# EAGLE schematic PH_EC_Module (EAGLE 9.1.2)

## Sheet 1 of 2
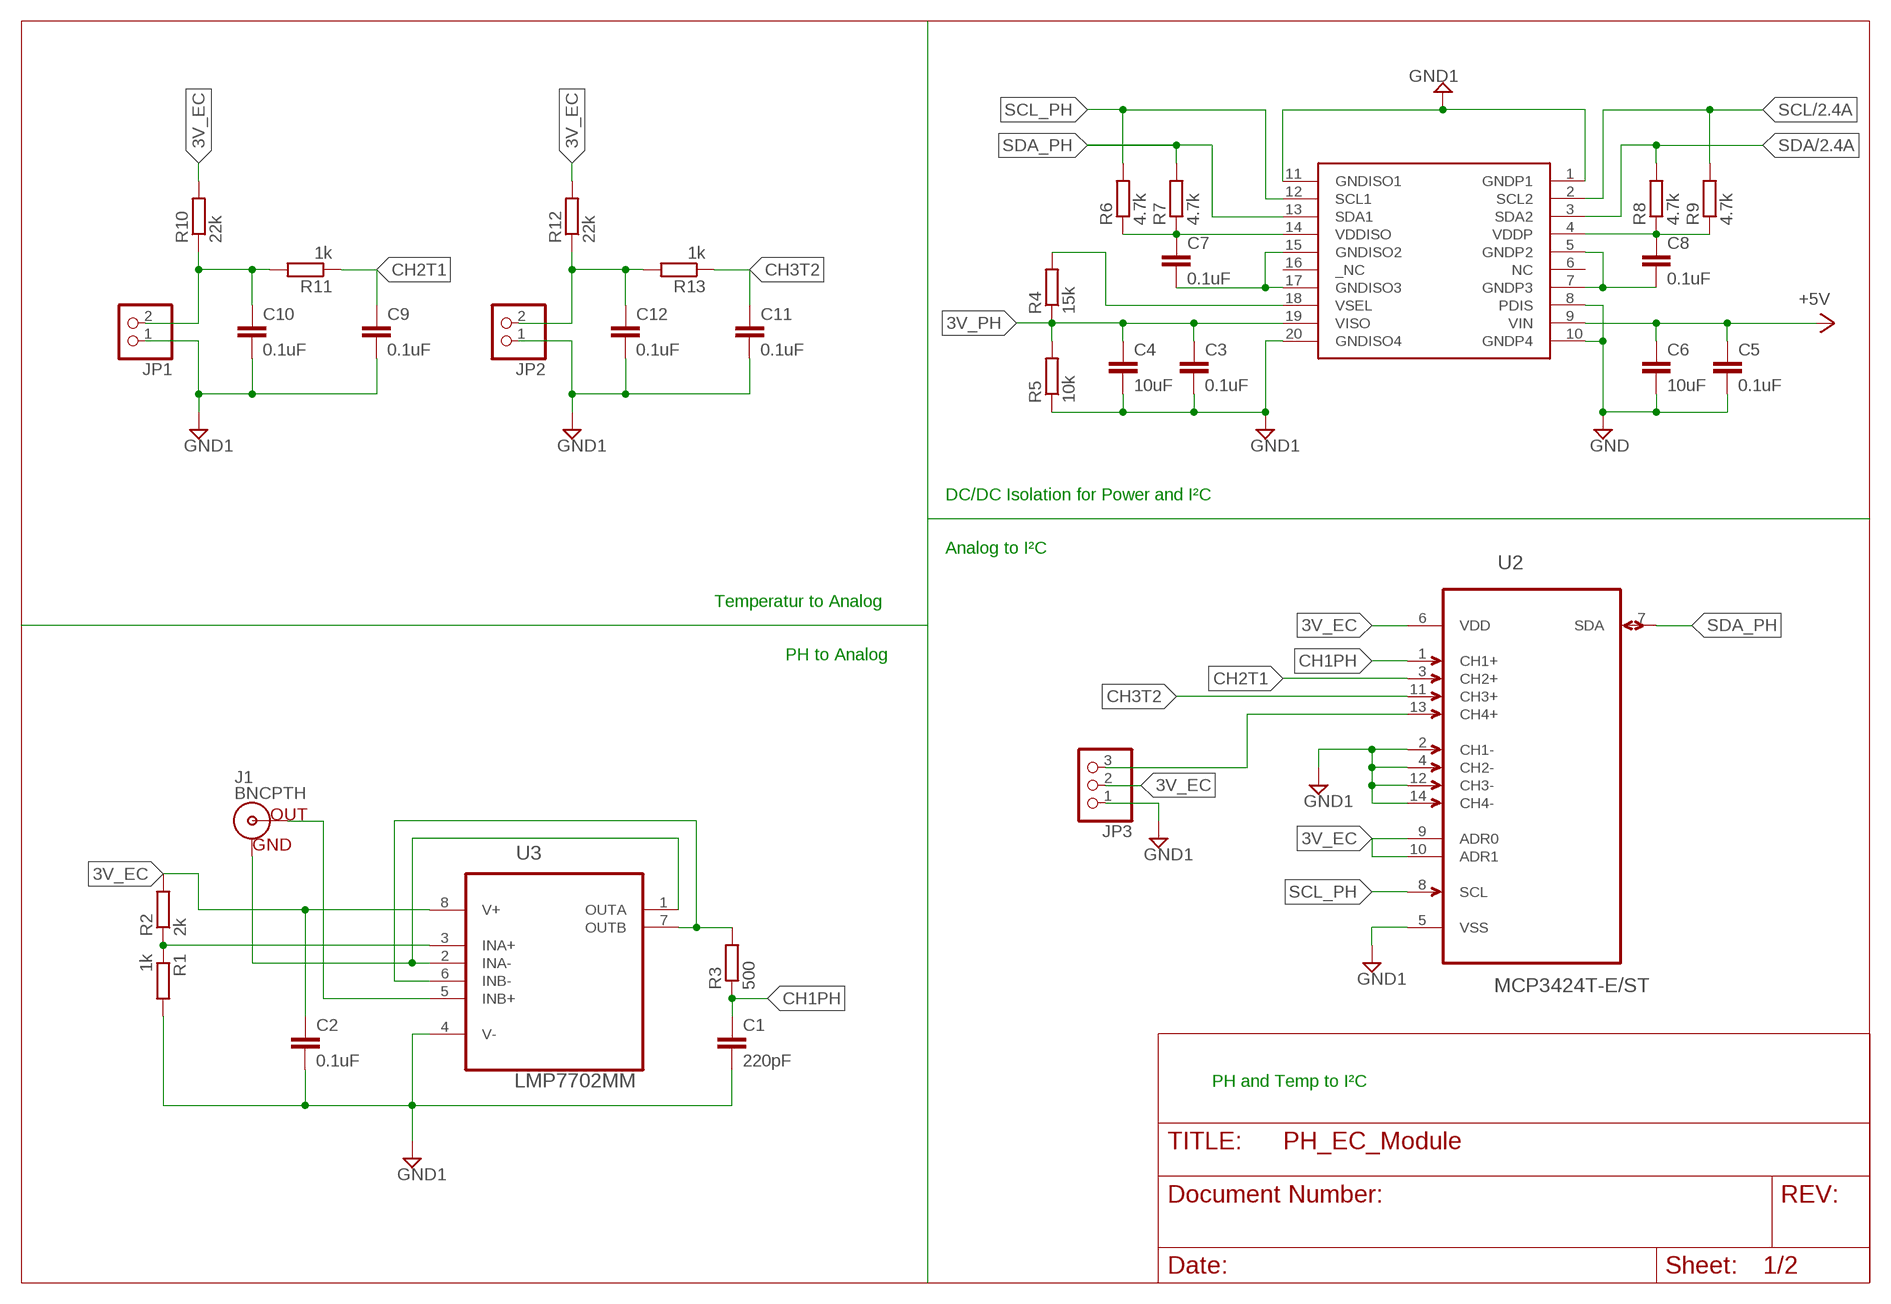
[diagram p0: schematic, sheet 1]

### Parts
C1  220pF  C-EUC1210  [C1210]
C2  0.1uF  C-EUC1210  [C1210]
C3  0.1uF  C-EUC1210  [C1210]
C4  10uF  C-EUC1210  [C1210]
C5  0.1uF  C-EUC1210  [C1210]
C6  10uF  C-EUC1210  [C1210]
C7  0.1uF  C-EUC1210  [C1210]
C8  0.1uF  C-EUC1210  [C1210]
C9  0.1uF  C-EUC1210  [C1210]
C10  0.1uF  C-EUC1210  [C1210]
C11  0.1uF  C-EUC1210  [C1210]
C12  0.1uF  C-EUC1210  [C1210]
J1  BNCPTH  [BNC]
JP1  PINHD-1X2  [1X02]
JP2  PINHD-1X2  [1X02]
JP3  PINHD-1X3  [1X03]
R1  1k  R-EU_M1206  [M1206]
R2  2k  R-EU_M1206  [M1206]
R3  500  R-EU_M1206  [M1206]
R4  15k  R-EU_M1206  [M1206]
R5  10k  R-EU_M1206  [M1206]
R6  4.7k  R-EU_M1206  [M1206]
R7  4.7k  R-EU_M1206  [M1206]
R8  4.7k  R-EU_M1206  [M1206]
R9  4.7k  R-EU_M1206  [M1206]
R10  22k  R-EU_M1206  [M1206]
R11  1k  R-EU_M1206  [M1206]
R12  22k  R-EU_M1206  [M1206]
R13  1k  R-EU_M1206  [M1206]
U1  ADM3260  [SOP65P640X120-20N]
U2  MCP3424T-E/ST  [SOP65P640X120-14N]
U3  LMP7702MM  [SOP65P490X109-8N]

### Nets
3V_EC: C2.1 R2.2 R10.2 R12.2 U2.6(VDD) U2.9(ADR0) U2.10(ADR1) U3.8(V+)
3V_PH: C3.1 C4.1 R4.1 R5.2 U1.19(VISO)
+5V: C5.1 C6.1 U1.9(VIN) ; also sheet 2
CH1PH: C1.1 R3.1 U2.1(CH1+)
CH2T1: C9.1 R11.1 U2.3(CH2+)
CH3T2: C11.1 R13.1 U2.11(CH3+)
GND: C5.2 C6.2 U1.8(PDIS) U1.10(GNDP4) ; also sheet 2
GND1: C1.2 C2.2 C3.2 C4.2 C9.2 C10.2 C11.2 C12.2 JP1.1 JP2.1 JP3.1 R1.2 R5.1 U1.1(GNDP1) U1.11(GNDISO1) U1.20(GNDISO4) U2.2(CH1-) U2.4(CH2-) U2.5(VSS) U2.12(CH3-) U2.14(CH4-) U3.4(V-) ; also sheet 2
N$1: J1.GND U3.1(OUTA) U3.2(INA-)
N$2: C10.1 JP1.2 R10.1 R11.2
N$3: R3.2 U3.6(INB-) U3.7(OUTB)
N$4: R1.1 R2.1 U3.3(INA+)
N$5: JP3.3 U2.13(CH4+)
N$6: J1.S(OUT) U3.5(INB+)
N$7: C12.1 JP2.2 R12.1 R13.2
N$8: R4.2 U1.18(VSEL)
N$9: C7.1 R6.1 R7.1 U1.14(VDDISO)
N$10: C7.2 U1.15(GNDISO2) U1.17(GNDISO3)
N$11: C8.1 R8.1 R9.1 U1.4(VDDP)
N$12: C8.2 U1.5(GNDP2) U1.7(GNDP3)
N$13: JP3.2
SCL: R9.2 U1.2(SCL2) ; also sheet 2
SCL_PH: R6.2 U1.12(SCL1) U2.8(SCL)
SDA: R8.2 U1.3(SDA2) ; also sheet 2
SDA_PH: R7.2 U1.13(SDA1) U2.7(SDA)
Unconnected: U1.6(NC) U1.16(_NC)

### Notes on the sheet
- DC/DC Isolation for Power and I²C
- Analog to I²C
- Temperatur to Analog
- PH to Analog
- PH and Temp to I²C

## Sheet 2 of 2
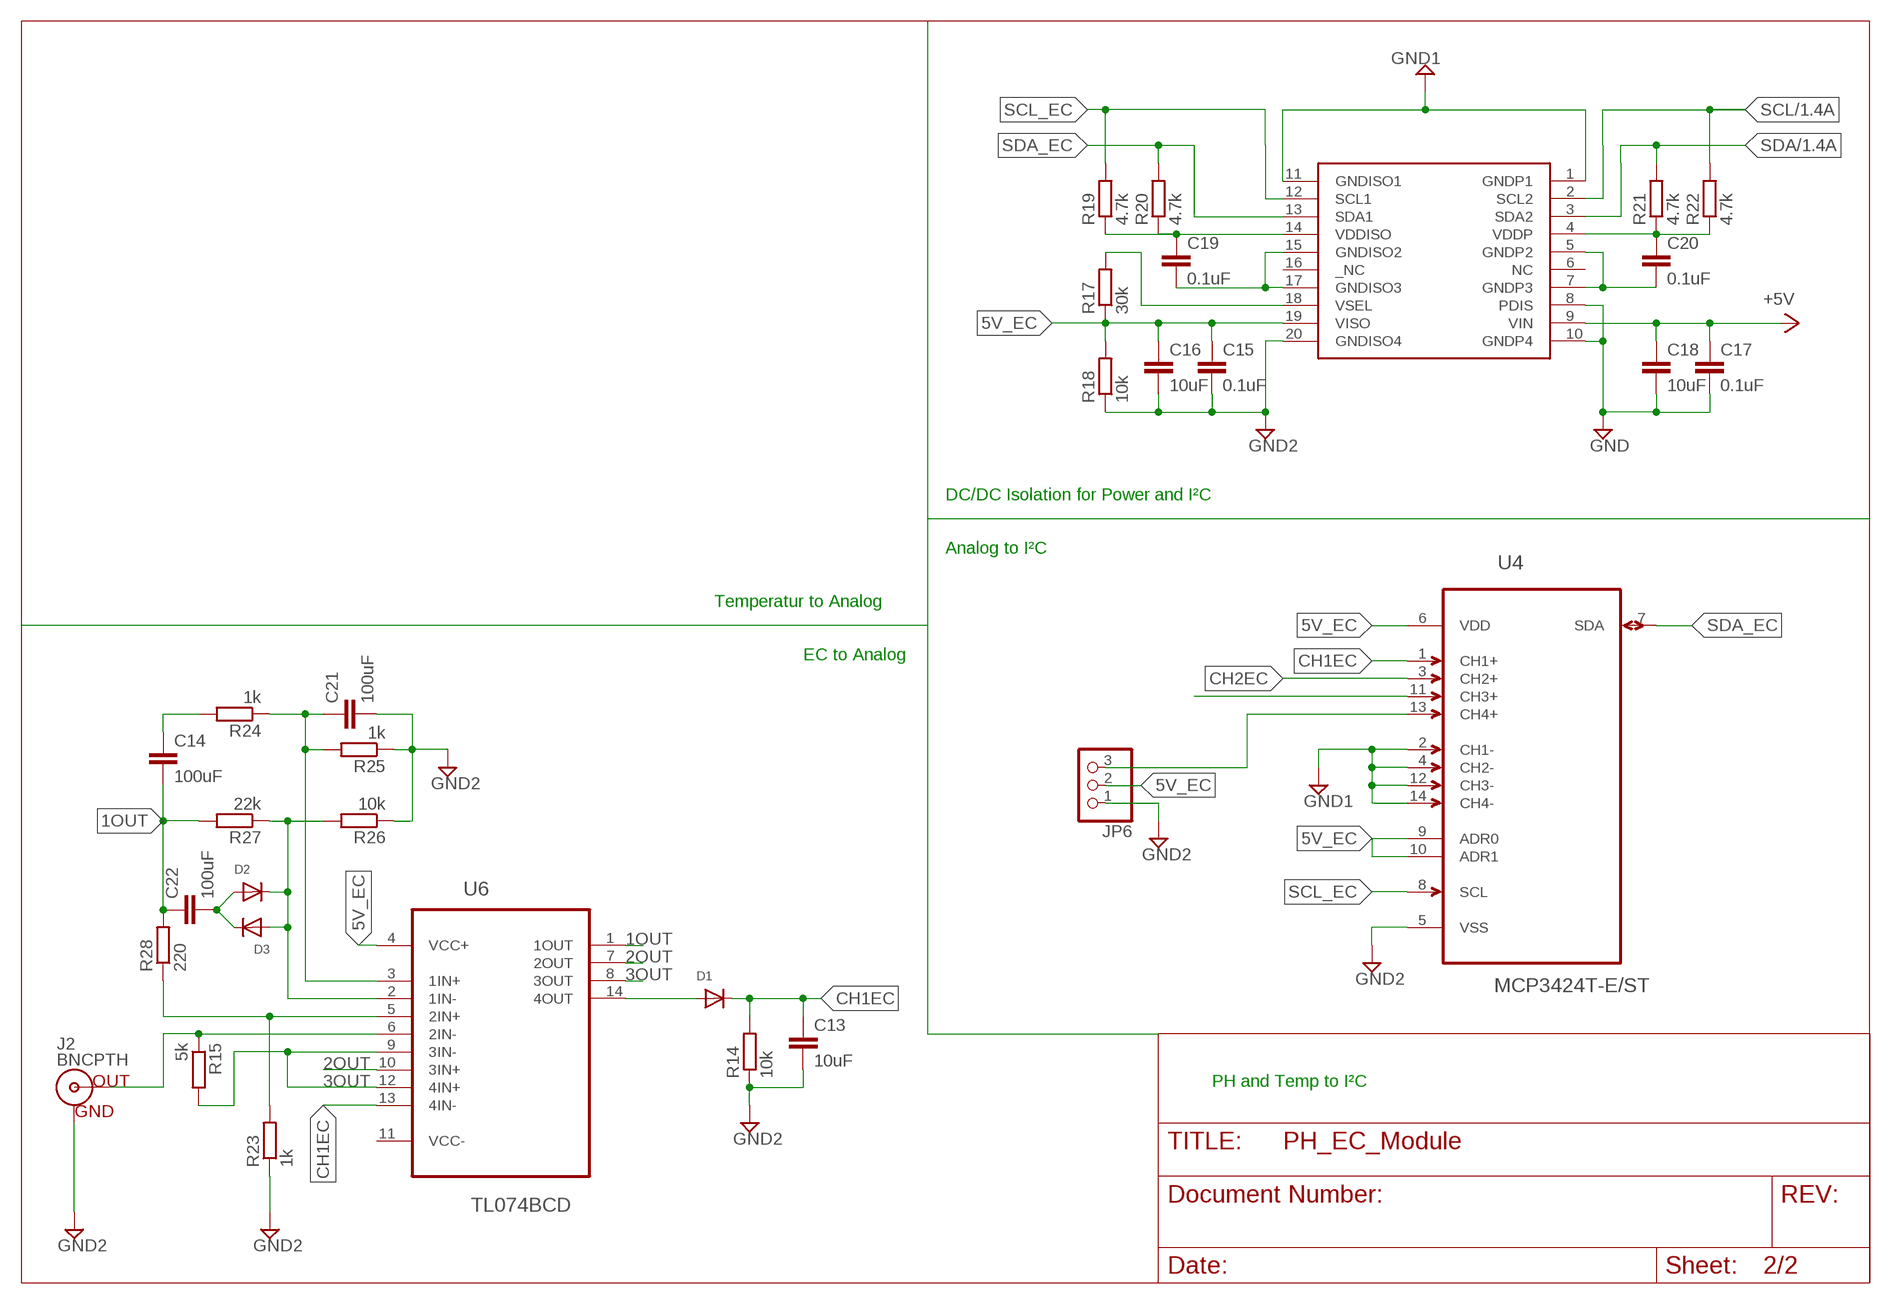
[diagram p1: schematic, sheet 2]

### Parts
C13  10uF  C-EUC1210  [C1210]
C14  100uF  C-EUC1210  [C1210]
C15  0.1uF  C-EUC1210  [C1210]
C16  10uF  C-EUC1210  [C1210]
C17  0.1uF  C-EUC1210  [C1210]
C18  10uF  C-EUC1210  [C1210]
C19  0.1uF  C-EUC1210  [C1210]
C20  0.1uF  C-EUC1210  [C1210]
C21  100uF  C-EUC1210  [C1210]
C22  100uF  C-EUC1210  [C1210]
D1  DIODESOD-123  [SOD-123]
D2  DIODESOD-123  [SOD-123]
D3  DIODESOD-123  [SOD-123]
J2  BNCPTH  [BNC]
JP6  PINHD-1X3  [1X03]
R14  10k  R-EU_M1206  [M1206]
R15  5k  R-EU_M1206  [M1206]
R17  30k  R-EU_M1206  [M1206]
R18  10k  R-EU_M1206  [M1206]
R19  4.7k  R-EU_M1206  [M1206]
R20  4.7k  R-EU_M1206  [M1206]
R21  4.7k  R-EU_M1206  [M1206]
R22  4.7k  R-EU_M1206  [M1206]
R23  1k  R-EU_M1206  [M1206]
R24  1k  R-EU_M1206  [M1206]
R25  1k  R-EU_M1206  [M1206]
R26  10k  R-EU_M1206  [M1206]
R27  22k  R-EU_M1206  [M1206]
R28  220  R-EU_M1206  [M1206]
U4  MCP3424T-E/ST  [SOP65P640X120-14N]
U5  ADM3260  [SOP65P640X120-20N]
U6  TL074BCD  [SOIC127P600X175-14N]

### Nets
1OUT: C14.2 C22.1 R27.2 R28.2 U6.1(1OUT)
2OUT: U6.7(2OUT) U6.10(3IN+)
3OUT: R15.2 U6.8(3OUT) U6.9(3IN-) U6.12(4IN+)
4OUT: D1.A U6.14(4OUT)
5V_EC: C15.1 C16.1 JP6.2 R17.1 R18.2 U4.6(VDD) U4.9(ADR0) U4.10(ADR1) U5.19(VISO) U6.4(VCC+)
+5V: C17.1 C18.1 U5.9(VIN) ; also sheet 1
CH1EC: C13.1 D1.C R14.2 U4.1(CH1+) U6.13(4IN-)
CH2EC: R23.2 R28.1 U4.3(CH2+) U6.5(2IN+)
CH3_T2: U4.11(CH3+)
GND: C17.2 C18.2 U5.8(PDIS) U5.10(GNDP4) ; also sheet 1
GND1: C15.2 C16.2 JP6.1 R18.1 U4.2(CH1-) U4.4(CH2-) U4.5(VSS) U4.12(CH3-) U4.14(CH4-) U5.1(GNDP1) U5.11(GNDISO1) U5.20(GNDISO4) ; supply symbol labelled GND2 ; also sheet 1
GND2: C13.2 C21.2 J2.GND R14.1 R23.1 R25.1 R26.1
N$15: C14.1 R24.2
N$16: C21.1 R24.1 R25.2 U6.3(1IN+)
N$19: R17.2 U5.18(VSEL)
N$20: C19.1 R19.1 R20.1 U5.14(VDDISO)
N$21: C19.2 U5.15(GNDISO2) U5.17(GNDISO3)
N$22: C20.1 R21.1 R22.1 U5.4(VDDP)
N$23: C20.2 U5.5(GNDP2) U5.7(GNDP3)
N$24: J2.S(OUT) R15.1 U6.6(2IN-)
N$25: C22.2 D2.A D3.C
N$26: JP6.3 U4.13(CH4+)
N$29: D2.C D3.A R26.2 R27.1 U6.2(1IN-)
SCL: R22.2 U5.2(SCL2) ; also sheet 1
SCL_EC: R19.2 U4.8(SCL) U5.12(SCL1)
SDA: R21.2 U5.3(SDA2) ; also sheet 1
SDA_EC: R20.2 U4.7(SDA) U5.13(SDA1)
Unconnected: U5.6(NC) U5.16(_NC)

### Notes on the sheet
- DC/DC Isolation for Power and I²C
- Analog to I²C
- Temperatur to Analog
- EC to Analog
- PH and Temp to I²C

## Power pins joined to a net without a drawn wire
VCC-: U6.11(VCC-)

## Library data of the parts
C1-C22 = resistor:C-EU: CAPACITOR, European symbol; SPICEPREFIX: C
D1-D3 = adafruit:DIODE: Diode SMADIODE - SMA Surface Mount Package 20V 1A Schottky Diode Digikey: 641-1014-6-ND DO-1N4148 - Through Hole Small Current Diode SOD-123 20V 1 A (.5mV Vf) Schottky Diode - Digikey: MBRX120TPMSCT-ND SOD-323 10V 570mA (.38mV Vf, 3ns) Schottky Diode - Digikey: ZLLS410CT-ND SOD-523 30V 30mA Schottky Diode (RB751S-40TE61) - Digikey: RB751S-40TE61CT-ND SOT23-R/W - SOT23 Package (R = Solder Paste/Reflow Ovens, W = Hand-Soldering) BAT54Film 40V 300mA - Digikey: 497-7162-1-ND
J1 J2 = SparkFun-Connectors:BNC: BNC Right Angle Connector Mouser Part# 5227161 SparkFun Products: BNC Connector - Right Angle <https://www.sparkfun.com/products/10550>; PROD_ID: LPA-12729; SF_ID: PRT-10550
JP1 JP2 = pinhead:PINHD-1X2: PIN HEADER
JP3 JP6 = pinhead:PINHD-1X3: PIN HEADER
R1-R15 R17-R28 = resistor:R-EU_: RESISTOR, European symbol
U1 U5 = LIB_ADM3260:ADM3260
U2 U4 = MCP3424T-E_ST:MCP3424T-E/ST: Analog-to-Digital Converter; AVAILABILITY: Good; DESCRIPTION: ADC Single Delta-Sigma 3.75sps 18-bit Serial 14-Pin TSSOP T/R; MF: Microchip; MP: MCP3424T-E/ST; PACKAGE: TSSOP-14 Microchip; PRICE: 3.40 USD
U3 = LMP7702MM:LMP7702MM: Op Amp; AVAILABILITY: Good; DESCRIPTION: Precision, CMOS Input, RRIO, Wide Supply Range Amplifiers 8-VSSOP -40 to 125; MF: Texas Instruments; MP: LMP7702MM; PACKAGE: MSOP-8 Texas Instruments; PRICE: 2.84 USD
U6 = TL074BCD:TL074BCD: LOW-NOISE JFET-INPUT OPERATIONAL AMPLIFIERS; AVAILABILITY: Good; DESCRIPTION: Low-Noise JFET-Input Operational Amplifier 14-SOIC 0 to 70; MF: Texas Instruments; MP: TL074BCD; PACKAGE: SOIC-14 Texas Instruments; PRICE: 0.68 USD